# Altium project stanok.PrjPcb
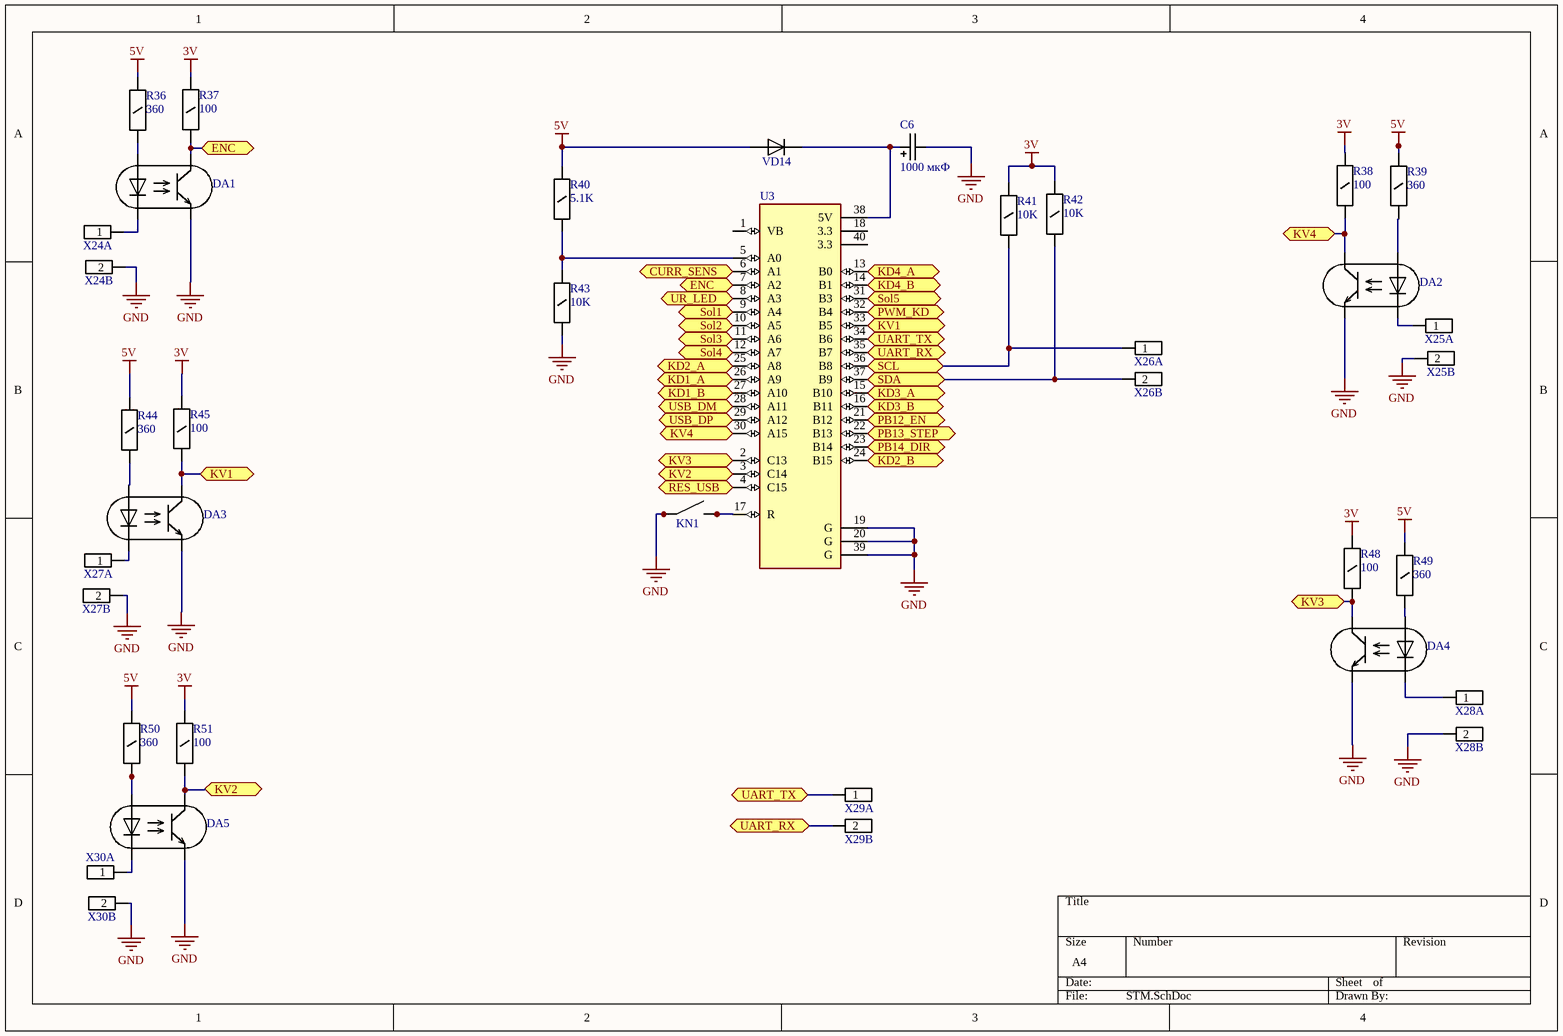
[diagram p0: STM.SchDoc]
6 sheets, 170 parts. Net scope: flat (ports and power ports of the same name join across sheets).
Board file: Board.PcbDoc
Sheets:
  STM.SchDoc
  IN_PIN.SchDoc
  OUT_MOT.SchDoc
  OUT_RELE.SchDoc
  PWR_IN.SchDoc
  USB.SchDoc

## Sheet STM.SchDoc
size A4; SheetNumber: 1

### Parts
C6  1000 мкФ  [C_12.5x5]
DA1  PC817  [SOIC254P1000X400-4N]  (value not drawn)
DA2  PC817  [SOIC254P1000X400-4N]  (value not drawn)
DA3  PC817  [SOIC254P1000X400-4N]  (value not drawn)
DA4  PC817  [SOIC254P1000X400-4N]  (value not drawn)
DA5  PC817  [SOIC254P1000X400-4N]  (value not drawn)
KN1  TS-A2PG-130  [TS-A2PG-130]  (value not drawn)
R36  360  [R_1206]
R37  100  [R_1206]
R38  100  [R_1206]
R39  360  [R_1206]
R40  5.1K  [R_1206]
R41  10K  [R_1206]
R42  10K  [R_1206]
R43  10K  [R_1206]
R44  360  [R_1206]
R45  100  [R_1206]
R48  100  [R_1206]
R49  360  [R_1206]
R50  360  [R_1206]
R51  100  [R_1206]
U3  STM32F103-BluePill  [MODULE_ZC323000]  (value not drawn)
VD14  1N4148W  [SOD-123]  (value not drawn)
X24  DG508V-02  [DG508V-02]  (value not drawn)  (parts A,B of 2)
X25  DG508V-02  [DG508V-02]  (value not drawn)  (parts A,B of 2)
X26  DG508V-02  [DG508V-02]  (value not drawn)  (parts A,B of 2)
X27  DG508V-02  [DG508V-02]  (value not drawn)  (parts A,B of 2)
X28  DG508V-02  [DG508V-02]  (value not drawn)  (parts A,B of 2)
X29  DG508V-02  [DG508V-02]  (value not drawn)  (parts A,B of 2)
X30  DG508V-02  [DG508V-02]  (value not drawn)  (parts A,B of 2)

### Ports
CURR_SENS, ENC, KD1_A, KD1_B, KD2_A, KD2_B, KD3_A, KD3_B, KD4_A, KD4_B, KV1, KV2, KV3, KV4, PB12_EN, PB13_STEP, PB14_DIR, PWM_KD, RES_USB, SCL, SDA, Sol1, Sol2, Sol3, Sol4, Sol5, UART_RX, UART_TX, UR_LED, USB_DM, USB_DP

### Nets
3V: R37.1 R38.1 R41.1 R42.1 R45.1 R48.1 R51.1
5V: R36.1 R39.1 R40.1 R44.1 R49.1 R50.1 VD14.A
GND: C6.2 DA1.3 DA2.3 DA3.3 DA4.3 DA5.3 KN1.1 KN1.2 R43.1 U3.19(G) U3.20(G) U3.39(G) X24.2 X25.2 X27.2 X28.2 X30.2
NetA1_14: R41.2 U3.36(B8) X26.1 ; port SCL
NetA1_15: R42.2 U3.37(B9) X26.2 ; port SDA
NetC6_1: C6.1 U3.38(5V) VD14.K
NetDA1_1: DA1.1 R36.2
NetDA1_2: DA1.2 X24.1
NetDA1_4: DA1.4 R37.2 U3.7(A2) ; port ENC
NetDA2_1: DA2.1 R39.2
NetDA2_2: DA2.2 X25.1
NetDA2_4: DA2.4 R38.2 U3.30(A15) ; port KV4
NetDA3_1: DA3.1 R44.2
NetDA3_2: DA3.2 X27.1
NetDA3_4: DA3.4 R45.2 U3.33(B5) ; port KV1
NetDA4_1: DA4.1 R49.2
NetDA4_2: DA4.2 X28.1
NetDA4_4: DA4.4 R48.2 U3.2(C13) ; port KV3
NetDA5_1: DA5.1 R50.2
NetDA5_2: DA5.2 X30.1
NetDA5_4: DA5.4 R51.2 U3.3(C14) ; port KV2
NetDA6_2: U3.10(A5) ; port Sol2
NetDA8_2: U3.9(A4) ; port Sol1
NetDA9_2: U3.12(A7) ; port Sol4
NetDA10_2: U3.31(B3) ; port Sol5
NetKN1_3: KN1.3 KN1.4 U3.17(R)
NetR1_1: U3.28(A11) ; port USB_DM
NetR2_1: U3.29(A12) ; port USB_DP
NetR4_1: U3.4(C15) ; port RES_USB
NetR5_2: U3.6(A1) ; port CURR_SENS
NetR12_1: U3.26(A9) ; port KD1_A
NetR13_1: U3.25(A8) ; port KD2_A
NetR14_1: U3.15(B10) ; port KD3_A
NetR15_1: U3.13(B0) ; port KD4_A
NetR16_1: U3.21(B12) ; port PB12_EN
NetR22_1: U3.16(B11) ; port KD3_B
NetR23_1: U3.27(A10) ; port KD1_B
NetR24_1: U3.24(B15) ; port KD2_B
NetR25_1: U3.14(B1) ; port KD4_B
NetR26_1: U3.23(B14) ; port PB14_DIR
NetR32_1: U3.22(B13) ; port PB13_STEP
NetR34_1: U3.8(A3) ; port UR_LED
NetR35_1: U3.32(B4) ; port PWM_KD
NetR40_2: R40.2 R43.2 U3.5(A0)
NetR55_2: U3.11(A6) ; port Sol3
NetU3_34: U3.34(B6) X29.1 ; port UART_TX
NetU3_35: U3.35(B7) X29.2 ; port UART_RX

Not connected (* = marked no-connect by the designer): U3 1(VB) 18(3.3) 40(3.3)

### Library data of the parts
C6 = Конденсатор 16х7.5: К50-35; Tolerance: 20%; Type: Электролитический конденсатор; Life: 2000 часов; Name: К50-35; Value: 1000 мкФ; Mounting: в отверстие
DA1-DA5 = KPC357NT: оптрон, SMD; Name: PC817; Mounting: SMD
KN1 = TS-A2PG-130 (5-й вывод): Кнопка 5 мм; Name: TS-A2PG-130; Height: 5 mm
R36-R45 R48-R51 = Резистор 1206: 0,25 Вт; Name: 1206; Power: 0.25 Вт; Tolerance: 5%; Voltage: 200В; Type: Резистор ЧИП; Mounting: SMD
  R36 R39 R44 R49 R50: Value: 360
  R37 R38 R45 R48 R51: Value: 100
  R40: Value: 5.1K
  R41-R43: Value: 10K
U3 = ZC323000: STM32F103C8T6 ARM STM32 Minimum System Development Board Module For Arduino; MF: YKS; Package: None; Availability: Unavailable; MP: STM32F103-BluePill; SnapEDA_Link: https://www.snapeda.com/parts/ZC323000/YKS/view-part/725364/?ref=snap; Value: *; Price: None
VD14 = 1N4148W: диод, SMD; Max current: 150 mA; Drop voltage: 1.25 В; Max voltage: 100 В; Power: 410 мВт; Name: 1N4148W; Mounting: SMD; Temperature: -65 .. +150
X24-X30 = DG508V-02: клеммник винтовой 2к.,5.08мм; Analog: MKDS 2/3; Name: DG508V-02; Type: шаг 5,08 мм; Mounting: в отверстие

## Sheet IN_PIN.SchDoc
size A4; SheetNumber: 2
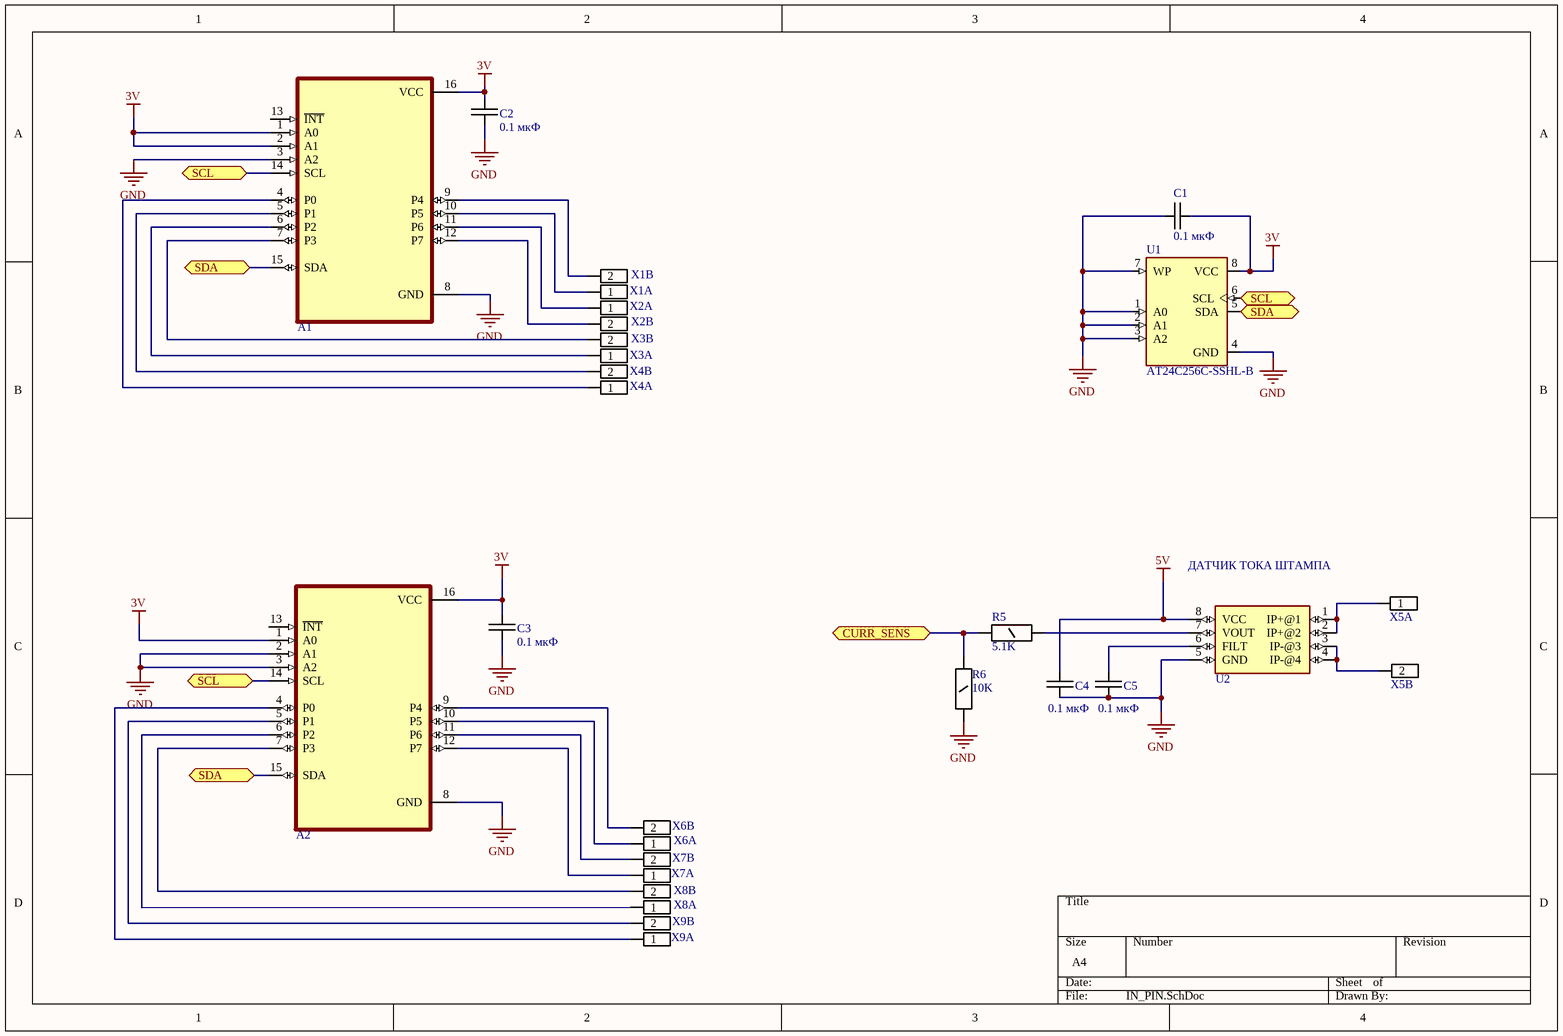
[diagram p1: IN_PIN.SchDoc]

### Parts
A1  PCF8574DW  [SOIC127P1030X265-16N]  (value not drawn)
A2  PCF8574DW  [SOIC127P1030X265-16N]  (value not drawn)
C1  0.1 мкФ  [C_0805]
C2  0.1 мкФ  [C_1206]
C3  0.1 мкФ  [C_1206]
C4  0.1 мкФ  [C_1206]
C5  0.1 мкФ  [C_1206]
R5  5.1K  [R_1206]
R6  10K  [R_1206]
U1  AT24C256C-SSHL-B  [SOIC8]
U2  ACS712  [SO08]  (value not drawn)
X1  DG508V-02  [DG508V-02]  (value not drawn)  (parts A,B of 2)
X2  DG508V-02  [DG508V-02]  (value not drawn)  (parts A,B of 2)
X3  DG508V-02  [DG508V-02]  (value not drawn)  (parts A,B of 2)
X4  DG508V-02  [DG508V-02]  (value not drawn)  (parts A,B of 2)
X5  DG508V-02  [DG508V-02]  (value not drawn)  (parts A,B of 2)
X6  DG508V-02  [DG508V-02]  (value not drawn)  (parts A,B of 2)
X7  DG508V-02  [DG508V-02]  (value not drawn)  (parts A,B of 2)
X8  DG508V-02  [DG508V-02]  (value not drawn)  (parts A,B of 2)
X9  DG508V-02  [DG508V-02]  (value not drawn)  (parts A,B of 2)

### Ports
CURR_SENS, SCL, SDA

### Nets
3V: A1.1(A0) A1.2(A1) A1.16(VCC) A2.1(A0) A2.16(VCC) C1.1 C2.1 C3.1 U1.8(VCC)
5V: C4.1 U2.8(VCC)
GND: A1.3(A2) A1.8(GND) A2.2(A1) A2.3(A2) A2.8(GND) C1.2 C2.2 C3.2 C4.2 C5.2 R6.2 U1.1(A0) U1.2(A1) U1.3(A2) U1.4(GND) U1.7(WP) U2.5(GND)
NetA1_4: A1.4(P0) X4.1
NetA1_5: A1.5(P1) X4.2
NetA1_6: A1.6(P2) X3.1
NetA1_7: A1.7(P3) X3.2
NetA1_9: A1.9(P4) X1.2
NetA1_10: A1.10(P5) X1.1
NetA1_11: A1.11(P6) X2.1
NetA1_12: A1.12(P7) X2.2
NetA1_14: A1.14(SCL) A2.14(SCL) U1.6(SCL) ; port SCL
NetA1_15: A1.15(SDA) A2.15(SDA) U1.5(SDA) ; port SDA
NetA2_4: A2.4(P0) X9.1
NetA2_5: A2.5(P1) X9.2
NetA2_6: A2.6(P2) X8.1
NetA2_7: A2.7(P3) X8.2
NetA2_9: A2.9(P4) X6.2
NetA2_10: A2.10(P5) X6.1
NetA2_11: A2.11(P6) X7.2
NetA2_12: A2.12(P7) X7.1
NetC5_1: C5.1 U2.6(FILT)
NetR5_1: R5.1 U2.7(VOUT)
NetR5_2: R5.2 R6.1 ; port CURR_SENS
NetU2_1: U2.1(IP+@1) U2.2(IP+@2) X5.1
NetU2_3: U2.3(IP-@3) U2.4(IP-@4) X5.2

Not connected (* = marked no-connect by the designer): A1 13(~{INT}); A2 13(~{INT})

### Notes on the sheet
- (near U2) ДАТЧИК ТОКА ШТАМПА

### Library data of the parts
A1 A2 = PCF8574DW: Remote 8-Bit I/O Expander for I2C-Bus 16-SOIC -40 to 85; MF: Texas Instruments; Package: SOIC-16 Texas Instruments; SnapEDA_Link: https://www.snapeda.com/parts/PCF8574DW/Texas%20Instruments/view-part/480923/?ref=snap; DigiKey-Purchase-URL: https://snapeda.com/shop?store=DigiKey&id=480923; MP: PCF8574DW; Value: *; Availability: Unavailable; Texas_Instruments-Purchase-URL: https://snapeda.com/shop?store=Texas+Instruments&id=480923; Price: None; Mouser-Purchase-URL: https://snapeda.com/shop?store=Mouser&id=480923
C1-C3 = Конденсатор 0805: SMD; Name: 0805; Voltage: 50B; Tolerance: 10%; Type: Конденсатор ЧИП; Value: 0.1 мкФ; Mounting: SMD
C4 C5 = Конденсатор 0603: SMD; Name: 0603; Voltage: 50B; Tolerance: 10%; Type: Конденсатор ЧИП; Value: 0.1 мкФ; Mounting: SMD
R5 = Резистор 1206: 0,25 Вт; Name: 1206; Type: Резистор ЧИП; Mounting: SMD
R6 = Резистор 1206: as R36 on sheet STM; Type: Резистор ЧИП; Value: 10K; Mounting: SMD
U1 = AT24C256C-SSHL-B: EEPROM Memory IC 256Kb _32K x 8_ IÂ²C 1MHz 550ns 8-SOIC; MF: Microchip; Value: *; SnapEDA_Link: https://www.snapeda.com/parts/AT24C256C-SSHL-B/Microchip/view-part/2112315/?ref=snap; Package: SO-8 Microchip; MP: AT24C256C-SSHL-B; Digi-Key_Purchase_URL: https://www.digikey.sg/product-detail/en/microchip-technology/AT24C256C-SSHL-B/AT24C256C-SSHL-B-ND/2271121?utm_source=snapeda&utm_medium=aggregator&utm_campaign=symbol; Digi-Key_Part_Number: AT24C256C-SSHL-B-ND
U2 = ACS712: Current Sensor 5A 1 Channel Hall Effect, Open Loop Bidirectional 8-SOIC (0.154, 3.90mm Width); MF: Allegro MicroSystems; Availability: In Stock; MP: ACS712; Price: None; Value: *; SnapEDA_Link: https://www.snapeda.com/parts/ACS712/Allegro+MicroSystems+LLC/view-part/?ref=snap; Check_prices: https://www.snapeda.com/parts/ACS712/Allegro+MicroSystems+LLC/view-part/?ref=eda; Package: None
X1-X9 = DG508V-02: as X24 on sheet STM; Name: DG508V-02; Type: шаг 5,08 мм; Mounting: в отверстие

## Sheet OUT_MOT.SchDoc
size A4; SheetNumber: 3
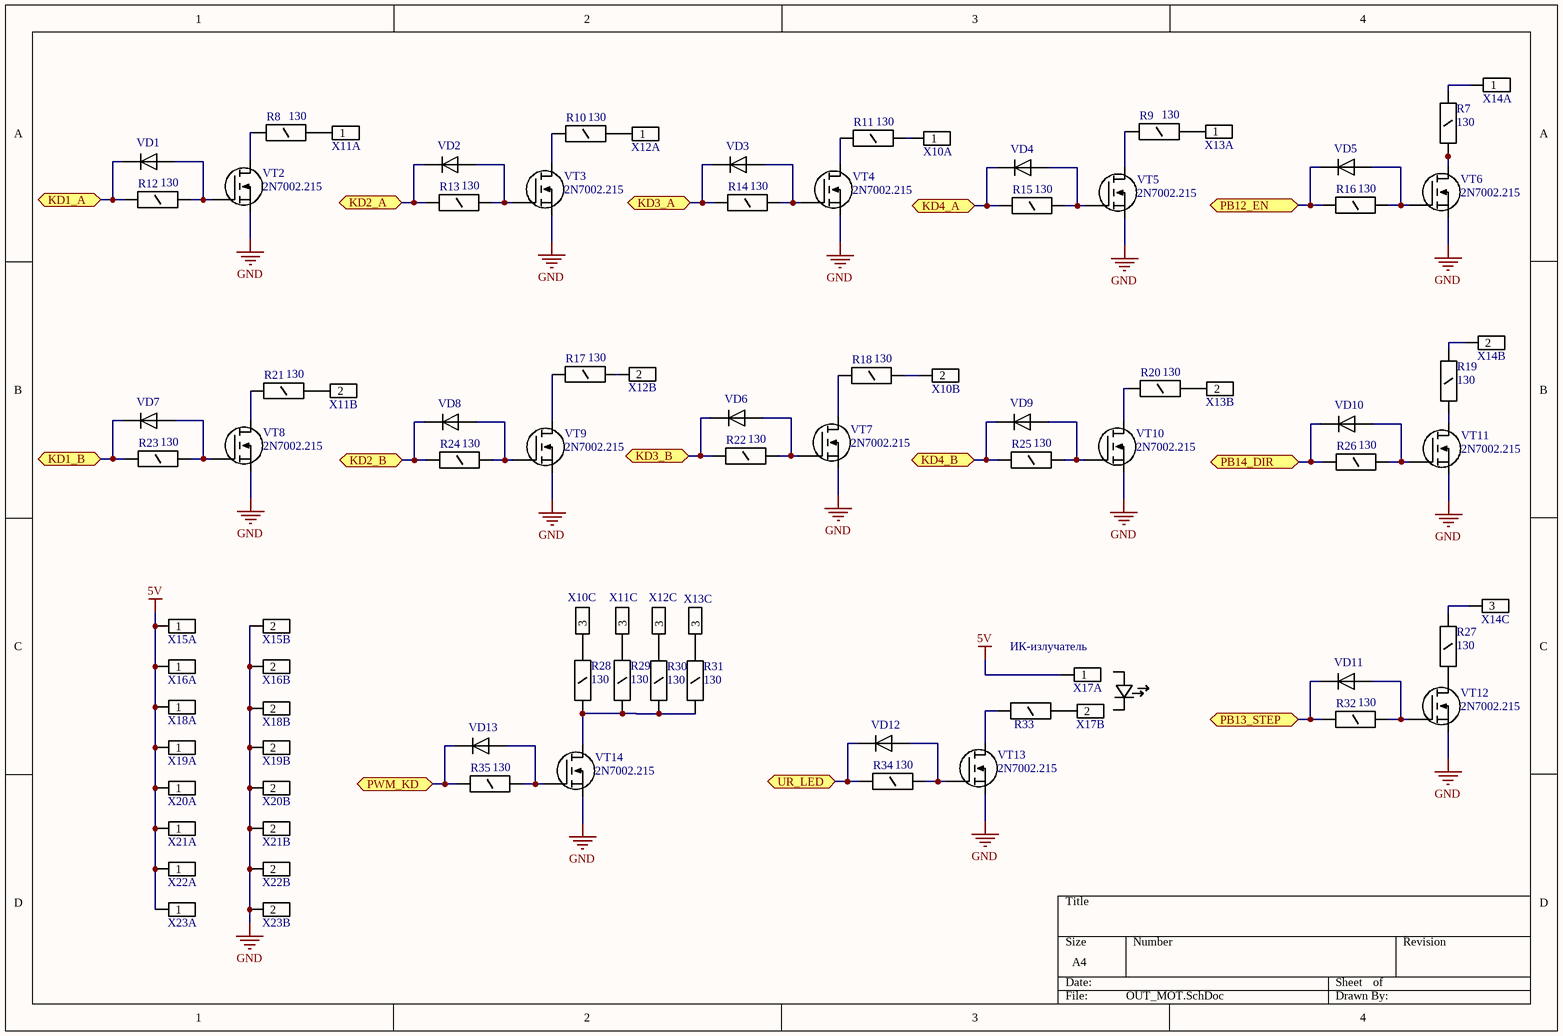
[diagram p2: OUT_MOT.SchDoc]

### Parts
R7  130  [R_1206]
R8  130  [R_1206]
R9  130  [R_1206]
R10  130  [R_1206]
R11  130  [R_1206]
R12  130  [R_1206]
R13  130  [R_1206]
R14  130  [R_1206]
R15  130  [R_1206]
R16  130  [R_1206]
R17  130  [R_1206]
R18  130  [R_1206]
R19  130  [R_1206]
R20  130  [R_1206]
R21  130  [R_1206]
R22  130  [R_1206]
R23  130  [R_1206]
R24  130  [R_1206]
R25  130  [R_1206]
R26  130  [R_1206]
R27  130  [R_1206]
R28  130  [R_1206]
R29  130  [R_1206]
R30  130  [R_1206]
R31  130  [R_1206]
R32  130  [R_1206]
R33  0  [R_1206]  (value not drawn)
R34  130  [R_1206]
R35  130  [R_1206]
VD1  MBR0520LT1G  [SOD-123]  (value not drawn)
VD2  MBR0520LT1G  [SOD-123]  (value not drawn)
VD3  MBR0520LT1G  [SOD-123]  (value not drawn)
VD4  MBR0520LT1G  [SOD-123]  (value not drawn)
VD5  MBR0520LT1G  [SOD-123]  (value not drawn)
VD6  MBR0520LT1G  [SOD-123]  (value not drawn)
VD7  MBR0520LT1G  [SOD-123]  (value not drawn)
VD8  MBR0520LT1G  [SOD-123]  (value not drawn)
VD9  MBR0520LT1G  [SOD-123]  (value not drawn)
VD10  MBR0520LT1G  [SOD-123]  (value not drawn)
VD11  MBR0520LT1G  [SOD-123]  (value not drawn)
VD12  MBR0520LT1G  [SOD-123]  (value not drawn)
VD13  MBR0520LT1G  [SOD-123]  (value not drawn)
VT2  2N7002.215  [SOT23]
VT3  2N7002.215  [SOT23]
VT4  2N7002.215  [SOT23]
VT5  2N7002.215  [SOT23]
VT6  2N7002.215  [SOT23]
VT7  2N7002.215  [SOT23]
VT8  2N7002.215  [SOT23]
VT9  2N7002.215  [SOT23]
VT10  2N7002.215  [SOT23]
VT11  2N7002.215  [SOT23]
VT12  2N7002.215  [SOT23]
VT13  2N7002.215  [SOT23]
VT14  2N7002.215  [SOT23]
X10  300-031-12  [300-031-12]  (value not drawn)  (parts A,B,C of 3)
X11  300-031-12  [300-031-12]  (value not drawn)  (parts A,B,C of 3)
X12  300-031-12  [300-031-12]  (value not drawn)  (parts A,B,C of 3)
X13  300-031-12  [300-031-12]  (value not drawn)  (parts A,B,C of 3)
X14  300-031-12  [300-031-12]  (value not drawn)  (parts A,B,C of 3)
X15  DG508V-02  [DG508V-02]  (value not drawn)  (parts A,B of 2)
X16  DG508V-02  [DG508V-02]  (value not drawn)  (parts A,B of 2)
X17  DG508V-02  [DG508V-02]  (value not drawn)  (parts A,B of 2)
X18  DG508V-02  [DG508V-02]  (value not drawn)  (parts A,B of 2)
X19  DG508V-02  [DG508V-02]  (value not drawn)  (parts A,B of 2)
X20  DG508V-02  [DG508V-02]  (value not drawn)  (parts A,B of 2)
X21  DG508V-02  [DG508V-02]  (value not drawn)  (parts A,B of 2)
X22  DG508V-02  [DG508V-02]  (value not drawn)  (parts A,B of 2)
X23  DG508V-02  [DG508V-02]  (value not drawn)  (parts A,B of 2)

### Ports
KD1_A, KD1_B, KD2_A, KD2_B, KD3_A, KD3_B, KD4_A, KD4_B, PB12_EN, PB13_STEP, PB14_DIR, PWM_KD, UR_LED

### Nets
5V: X15.1 X16.1 X17.1 X18.1 X19.1 X20.1 X21.1 X22.1 X23.1
GND: VT2.2(S) VT3.2(S) VT4.2(S) VT5.2(S) VT6.2(S) VT7.2(S) VT8.2(S) VT9.2(S) VT10.2(S) VT11.2(S) VT12.2(S) VT13.2(S) VT14.2(S) X15.2 X16.2 X18.2 X19.2 X20.2 X21.2 X22.2 X23.2
NetR7_1: R7.1 VT6.3(D)
NetR7_2: R7.2 X14.1
NetR8_1: R8.1 VT2.3(D)
NetR8_2: R8.2 X11.1
NetR9_1: R9.1 VT5.3(D)
NetR9_2: R9.2 X13.1
NetR10_1: R10.1 VT3.3(D)
NetR10_2: R10.2 X12.1
NetR11_1: R11.1 VT4.3(D)
NetR11_2: R11.2 X10.1
NetR12_1: R12.1 VD1.K ; port KD1_A
NetR12_2: R12.2 VD1.A VT2.1(G)
NetR13_1: R13.1 VD2.K ; port KD2_A
NetR13_2: R13.2 VD2.A VT3.1(G)
NetR14_1: R14.1 VD3.K ; port KD3_A
NetR14_2: R14.2 VD3.A VT4.1(G)
NetR15_1: R15.1 VD4.K ; port KD4_A
NetR15_2: R15.2 VD4.A VT5.1(G)
NetR16_1: R16.1 VD5.K ; port PB12_EN
NetR16_2: R16.2 VD5.A VT6.1(G)
NetR17_1: R17.1 VT9.3(D)
NetR17_2: R17.2 X12.2
NetR18_1: R18.1 VT7.3(D)
NetR18_2: R18.2 X10.2
NetR19_1: R19.1 VT11.3(D)
NetR19_2: R19.2 X14.2
NetR20_1: R20.1 VT10.3(D)
NetR20_2: R20.2 X13.2
NetR21_1: R21.1 VT8.3(D)
NetR21_2: R21.2 X11.2
NetR22_1: R22.1 VD6.K ; port KD3_B
NetR22_2: R22.2 VD6.A VT7.1(G)
NetR23_1: R23.1 VD7.K ; port KD1_B
NetR23_2: R23.2 VD7.A VT8.1(G)
NetR24_1: R24.1 VD8.K ; port KD2_B
NetR24_2: R24.2 VD8.A VT9.1(G)
NetR25_1: R25.1 VD9.K ; port KD4_B
NetR25_2: R25.2 VD9.A VT10.1(G)
NetR26_1: R26.1 VD10.K ; port PB14_DIR
NetR26_2: R26.2 VD10.A VT11.1(G)
NetR27_1: R27.1 VT12.3(D)
NetR27_2: R27.2 X14.3
NetR28_1: R28.1 R29.1 R30.1 R31.1 VT14.3(D)
NetR28_2: R28.2 X10.3
NetR29_2: R29.2 X11.3
NetR30_2: R30.2 X12.3
NetR31_2: R31.2 X13.3
NetR32_1: R32.1 VD11.K ; port PB13_STEP
NetR32_2: R32.2 VD11.A VT12.1(G)
NetR33_1: R33.1 X17.2
NetR33_2: R33.2 VT13.3(D)
NetR34_1: R34.1 VD12.K ; port UR_LED
NetR34_2: R34.2 VD12.A VT13.1(G)
NetR35_1: R35.1 VD13.K ; port PWM_KD
NetR35_2: R35.2 VD13.A VT14.1(G)

### Notes on the sheet
- (near X17) ИК-излучатель

### Library data of the parts
R7-R35 = Резистор 1206: as R36 on sheet STM; Type: Резистор ЧИП; Mounting: SMD
  R7-R32 R34 R35: Value: 130
  R33: Value: 0
VD1-VD13 = SMA400*: диод, SMD; Max current: 1 А; Drop voltage: 1.1 В; Name: MBR0520LT1G; Mounting: SMD; Temperature: -65 .. +175; Max voltage: ?
VT2-VT14 = 2N7002.215: MOSFET, SOT23; Type: МОП, N-канал; Package: SOT23; Name: 2N7002.215; Mounting: SMD
X10-X14 = 300-031-12: клеммник винтовой 3к.,5мм; Analog: DG300-5.0-03P; Name: 300-031-12; Type: шаг 5 мм; Mounting: в отверстие
X15-X23 = DG508V-02: as X24 on sheet STM; Name: DG508V-02; Type: шаг 5,08 мм; Mounting: в отверстие

## Sheet OUT_RELE.SchDoc
size A4; SheetNumber: 4
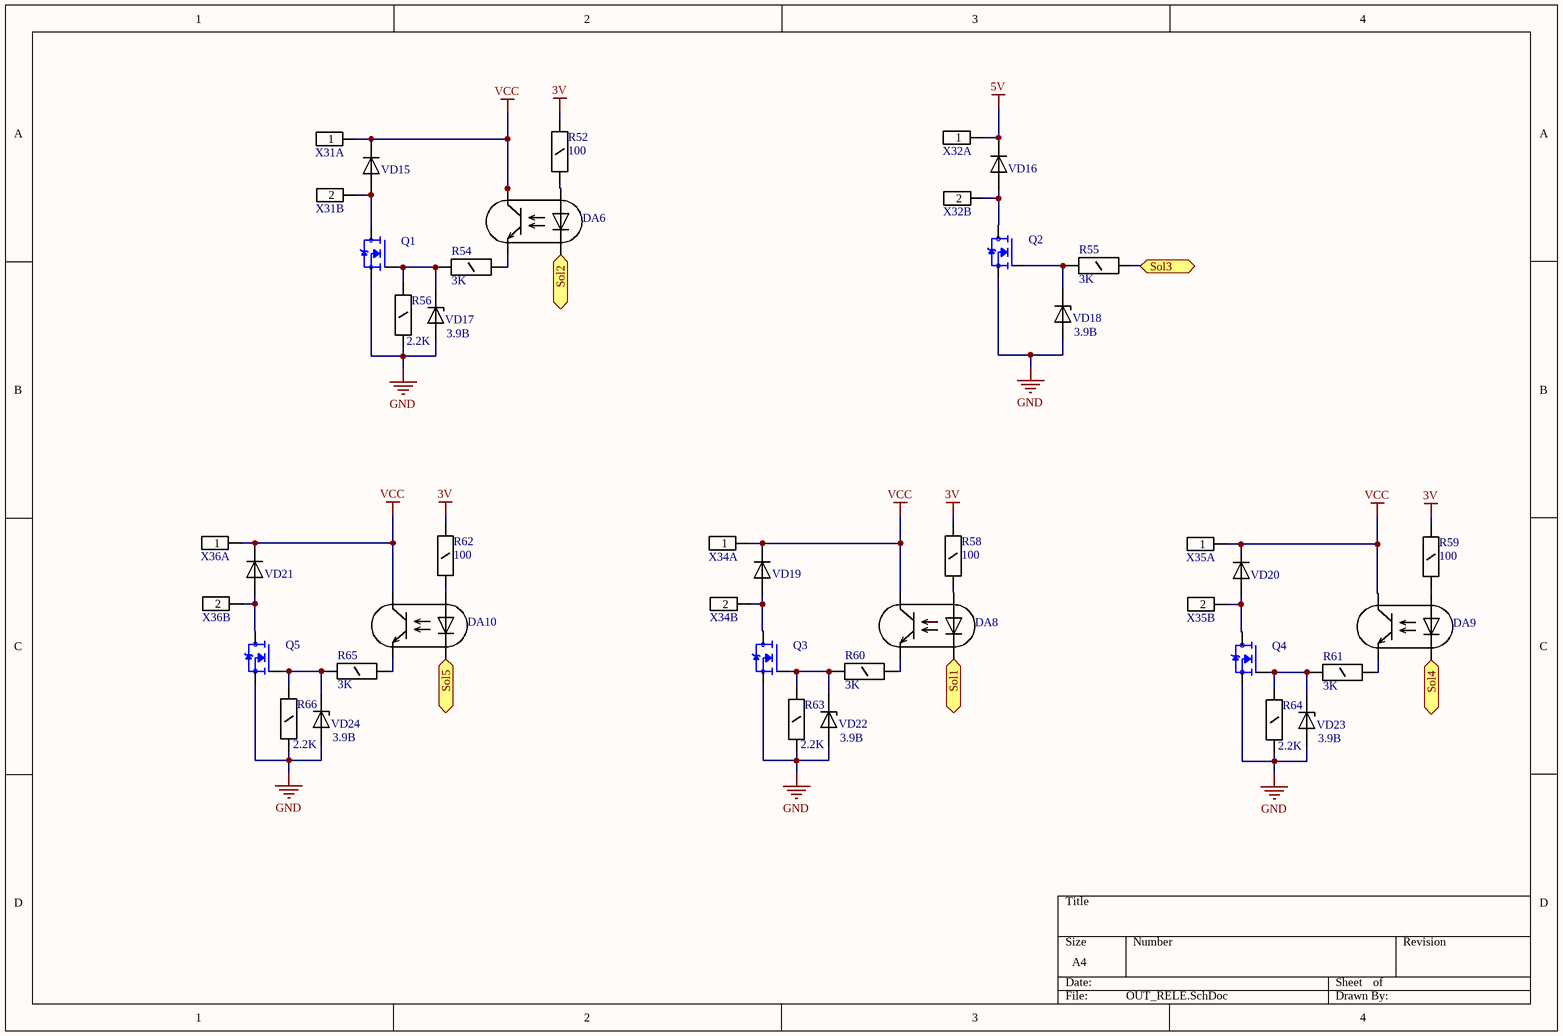
[diagram p3: OUT_RELE.SchDoc]

### Parts
DA6  PC817  [SOIC254P1000X400-4N]  (value not drawn)
DA8  PC817  [SOIC254P1000X400-4N]  (value not drawn)
DA9  PC817  [SOIC254P1000X400-4N]  (value not drawn)
DA10  PC817  [SOIC254P1000X400-4N]  (value not drawn)
Q1  IRFZ44N  [DPAK254P1524X483-3N]  (value not drawn)
Q2  IRFZ44N  [DPAK254P1524X483-3N]  (value not drawn)
Q3  IRFZ44N  [DPAK254P1524X483-3N]  (value not drawn)
Q4  IRFZ44N  [DPAK254P1524X483-3N]  (value not drawn)
Q5  IRFZ44N  [DPAK254P1524X483-3N]  (value not drawn)
R52  100  [R_1206]
R54  3K  [R_1206]
R55  3K  [R_1206]
R56  2.2K  [R_1206]
R58  100  [R_1206]
R59  100  [R_1206]
R60  3K  [R_1206]
R61  3K  [R_1206]
R62  100  [R_1206]
R63  2.2K  [R_1206]
R64  2.2K  [R_1206]
R65  3K  [R_1206]
R66  2.2K  [R_1206]
VD15  SMA4007  [SMA (DO-214AC)]  (value not drawn)
VD16  SMA4007  [SMA (DO-214AC)]  (value not drawn)
VD17  3.9В  [DL-35]
VD18  3.9В  [DL-35]
VD19  SMA4007  [SMA (DO-214AC)]  (value not drawn)
VD20  SMA4007  [SMA (DO-214AC)]  (value not drawn)
VD21  SMA4007  [SMA (DO-214AC)]  (value not drawn)
VD22  3.9В  [DL-35]
VD23  3.9В  [DL-35]
VD24  3.9В  [DL-35]
X31  DG508V-02  [DG508V-02]  (value not drawn)  (parts A,B of 2)
X32  DG508V-02  [DG508V-02]  (value not drawn)  (parts A,B of 2)
X34  DG508V-02  [DG508V-02]  (value not drawn)  (parts A,B of 2)
X35  DG508V-02  [DG508V-02]  (value not drawn)  (parts A,B of 2)
X36  DG508V-02  [DG508V-02]  (value not drawn)  (parts A,B of 2)

### Ports
Sol1, Sol2, Sol3, Sol4, Sol5

### Nets
3V: R52.1 R58.1 R59.1 R62.1
5V: VD16.K X32.1
GND: Q1.3(S) Q2.3(S) Q3.3(S) Q4.3(S) Q5.3(S) R56.1 R63.1 R64.1 R66.1 VD17.1 VD18.1 VD22.1 VD23.1 VD24.1
VCC: DA6.4 DA8.4 DA9.4 DA10.4 VD15.K VD19.K VD20.K VD21.K X31.1 X34.1 X35.1 X36.1
NetDA6_1: DA6.1 R52.2
NetDA6_2: DA6.2 ; port Sol2
NetDA6_3: DA6.3 R54.2
NetDA8_1: DA8.1 R58.2
NetDA8_2: DA8.2 ; port Sol1
NetDA8_3: DA8.3 R60.2
NetDA9_1: DA9.1 R59.2
NetDA9_2: DA9.2 ; port Sol4
NetDA9_3: DA9.3 R61.2
NetDA10_1: DA10.1 R62.2
NetDA10_2: DA10.2 ; port Sol5
NetDA10_3: DA10.3 R65.2
NetQ1_1: Q1.1(G) R54.1 R56.2 VD17.2
NetQ1_2: Q1.2(D) VD15.A X31.2
NetQ2_1: Q2.1(G) R55.1 VD18.2
NetQ2_2: Q2.2(D) VD16.A X32.2
NetQ3_1: Q3.1(G) R60.1 R63.2 VD22.2
NetQ3_2: Q3.2(D) VD19.A X34.2
NetQ4_1: Q4.1(G) R61.1 R64.2 VD23.2
NetQ4_2: Q4.2(D) VD20.A X35.2
NetQ5_1: Q5.1(G) R65.1 R66.2 VD24.2
NetQ5_2: Q5.2(D) VD21.A X36.2
NetR55_2: R55.2 ; port Sol3

### Library data of the parts
DA6 DA8-DA10 = KPC357NT: оптрон, SMD; Name: PC817; Mounting: SMD
Q1-Q5 = IRFZ44NSTRRPBF: N-Channel 55V 49A (Tc) 3.8W (Ta), 94W (Tc) Surface Mount D2PAK; MF: Infineon Technologies; Availability: Bad; Value: *; Check_prices: https://www.snapeda.com/parts/IRFZ44NSTRRPBF/Infineon%20Technologies/view-part/1356646/?ref=eda; Package: D2PAK Infineon; Price: None; MP: IRFZ44NSTRRPBF; SnapEDA_Link: https://www.snapeda.com/parts/IRFZ44NSTRRPBF/Infineon%20Technologies/view-part/1356646/?ref=snap
R52 R54-R56 R58-R66 = Резистор 1206: as R36 on sheet STM; Type: Резистор ЧИП; Mounting: SMD
  R52 R58 R59 R62: Value: 100
  R54 R55 R60 R61 R65: Value: 3K
  R56 R63 R64 R66: Value: 2.2K
VD15 VD16 VD19-VD21 = SMA400*: as VD1 on sheet OUT_MOT; Name: SMA4007; Mounting: SMD; Temperature: -65 .. +175; Max voltage: ?
VD17 VD18 VD22-VD24 = BZV55C***: стабилитрон, SMD; Name: SMAJ30A-TR; Power: 0.5 Вт; Mounting: SMD; Voltage: 3.9В; Temperature range: -55 ... +175
X31 X32 X34-X36 = DG508V-02: as X24 on sheet STM; Name: DG508V-02; Type: шаг 5,08 мм; Mounting: в отверстие

## Sheet PWR_IN.SchDoc
size A4
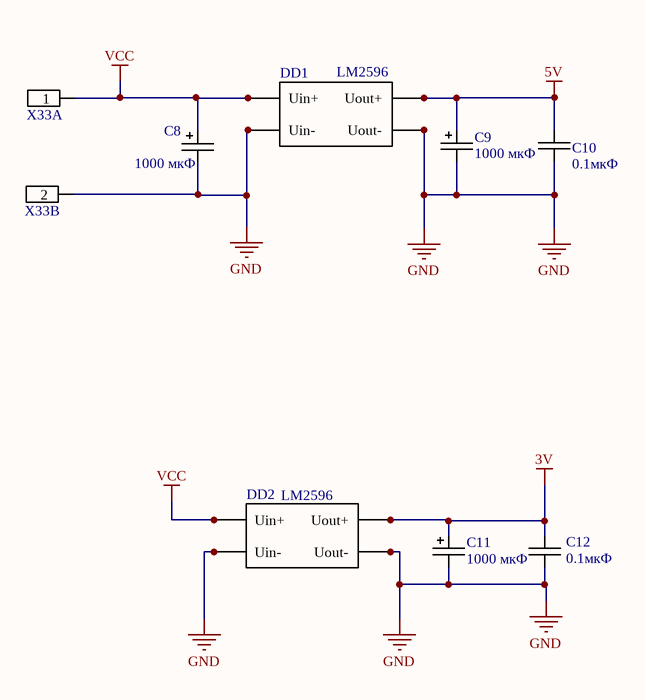
[diagram p4: PWR_IN.SchDoc]

### Parts
C8  1000 мкФ  [C_10x5]
C9  1000 мкФ  [C_10x5]
C10  0.1мкФ  [C_1206]
C11  1000 мкФ  [C_10x5]
C12  0.1мкФ  [C_1206]
DD1  LM2596  [LM2596]
DD2  LM2596  [LM2596]
X33  DG508V-02  [DG508V-02]  (value not drawn)  (parts A,B of 2)

### Nets
3V: C11.1 C12.1 DD2.5(Uout+) DD2.6(Uout+)
5V: C9.1 C10.1 DD1.5(Uout+) DD1.6(Uout+)
GND: C8.2 C9.2 C10.2 C11.2 C12.2 DD1.3(Uin-) DD1.4(Uin-) DD1.7(Uout-) DD1.8(Uout-) DD2.3(Uin-) DD2.4(Uin-) DD2.7(Uout-) DD2.8(Uout-) X33.2
VCC: C8.1 DD1.1(Uin+) DD1.2(Uin+) DD2.1(Uin+) DD2.2(Uin+) X33.1

### Library data of the parts
C8 C9 C11 = Конденсатор 25х12.5: К50-35; Tolerance: 20%; Type: Электролитический конденсатор; Life: 2000 часов; Name: К50-35; Value: 1000 мкФ; Mounting: в отверстие
C10 C12 = Конденсатор 1210: SMD; Name: 1210; Voltage: 50B; Tolerance: 10%; Type: Конденсатор ЧИП; Value: 0.1мкФ; Mounting: SMD
DD1 DD2 = LM2596: Блок питания; Mounting: в отверстие; Name: LM2596
X33 = DG508V-02: as X24 on sheet STM; Name: DG508V-02; Type: шаг 5,08 мм; Mounting: в отверстие

## Sheet USB.SchDoc
size A4
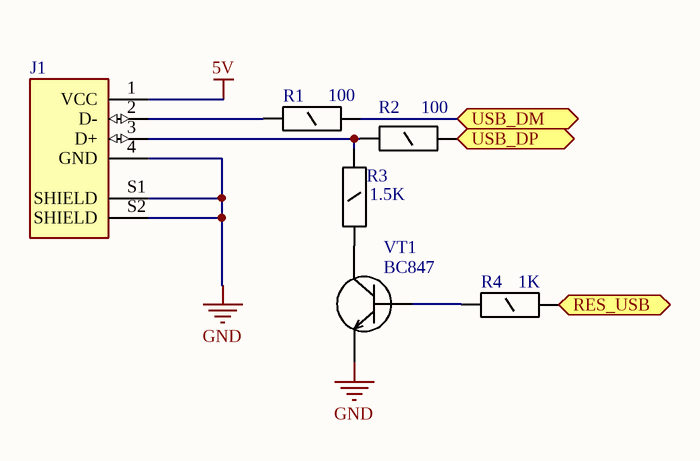
[diagram p5: USB.SchDoc]

### Parts
J1  USBB  [SAMTEC_USB-B-S-X-X-TH]  (value not drawn)
R1  100  [R_1206]
R2  100  [R_1206]
R3  1.5K  [R_1206]
R4  1K  [R_1206]
VT1  BC847  [SOT23]

### Ports
RES_USB, USB_DM, USB_DP

### Nets
5V: J1.1(VCC)
GND: J1.4(GND) J1.S1(SHIELD) J1.S2(SHIELD) VT1.2(E)
NetJ1_2: J1.2(D-) R1.2
NetJ1_3: J1.3(D+) R2.2 R3.1
NetR1_1: R1.1 ; port USB_DM
NetR2_1: R2.1 ; port USB_DP
NetR3_2: R3.2 VT1.3(K)
NetR4_1: R4.1 ; port RES_USB
NetR4_2: R4.2 VT1.1(B)

### Library data of the parts
J1 = USB-B-S-X-X-TH: USB-B (USB TYPE-B) USB 2.0 Receptacle Connector 4 Position Through Hole, Right Angle; MF: Samtec; MP: USBB; Availability: Unavailable; Package: None; SnapEDA_Link: https://www.snapeda.com/parts/USB-B-S-S-B-TH/Samtec%20Inc./view-part/230656/?ref=snap; Value: *; Price: None; Toby_UK-Purchase-URL: https://snapeda.com/shop?store=Toby+UK&id=230656
R1-R4 = Резистор 1206: as R36 on sheet STM; Type: Резистор ЧИП; Mounting: SMD
  R1 R2: Value: 100
  R3: Value: 1.5K
  R4: Value: 1K
VT1 = BC847: NPN, SMD; Type: Биполярный NPN; Analog: KT3130; Package: SOT23; Name: BC847; Mounting: SMD

## Nets that join several sheets
3V: STM (7 pins), IN_PIN (9 pins), OUT_RELE (R52.1 R58.1 R59.1 R62.1), PWR_IN (C11.1 C12.1 DD2.5 DD2.6)
5V: STM (7 pins), IN_PIN (C4.1 U2.8), OUT_MOT (9 pins), OUT_RELE (VD16.K X32.1), PWR_IN (C9.1 C10.1 DD1.5 DD1.6), USB (J1.1)
GND: STM (17 pins), IN_PIN (17 pins), OUT_MOT (21 pins), OUT_RELE (14 pins), PWR_IN (14 pins), USB (J1.4 J1.S1 J1.S2 VT1.2)
VCC: OUT_RELE (12 pins), PWR_IN (6 pins)
NetA1_14: STM (R41.2 U3.36 X26.1), IN_PIN (A1.14 A2.14 U1.6)
NetA1_15: STM (R42.2 U3.37 X26.2), IN_PIN (A1.15 A2.15 U1.5)
NetDA6_2: STM (U3.10), OUT_RELE (DA6.2)
NetDA8_2: STM (U3.9), OUT_RELE (DA8.2)
NetDA9_2: STM (U3.12), OUT_RELE (DA9.2)
NetDA10_2: STM (U3.31), OUT_RELE (DA10.2)
NetR1_1: STM (U3.28), USB (R1.1)
NetR2_1: STM (U3.29), USB (R2.1)
NetR4_1: STM (U3.4), USB (R4.1)
NetR5_2: STM (U3.6), IN_PIN (R5.2 R6.1)
NetR12_1: STM (U3.26), OUT_MOT (R12.1 VD1.K)
NetR13_1: STM (U3.25), OUT_MOT (R13.1 VD2.K)
NetR14_1: STM (U3.15), OUT_MOT (R14.1 VD3.K)
NetR15_1: STM (U3.13), OUT_MOT (R15.1 VD4.K)
NetR16_1: STM (U3.21), OUT_MOT (R16.1 VD5.K)
NetR22_1: STM (U3.16), OUT_MOT (R22.1 VD6.K)
NetR23_1: STM (U3.27), OUT_MOT (R23.1 VD7.K)
NetR24_1: STM (U3.24), OUT_MOT (R24.1 VD8.K)
NetR25_1: STM (U3.14), OUT_MOT (R25.1 VD9.K)
NetR26_1: STM (U3.23), OUT_MOT (R26.1 VD10.K)
NetR32_1: STM (U3.22), OUT_MOT (R32.1 VD11.K)
NetR34_1: STM (U3.8), OUT_MOT (R34.1 VD12.K)
NetR35_1: STM (U3.32), OUT_MOT (R35.1 VD13.K)
NetR55_2: STM (U3.11), OUT_RELE (R55.2)

## Assembly variants
Var_stanok_pcf8574_chip: all parts fitted